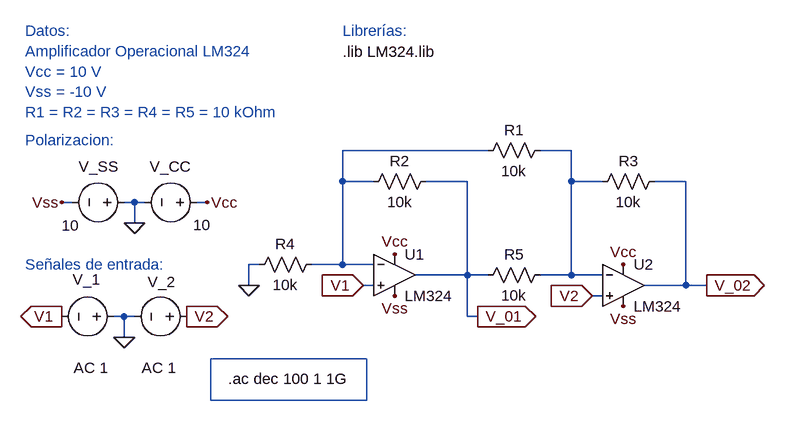
[diagram p0: schematic Lab_1_Circ_1_VD_frec.asc]
Lab_1_Circ_1_VD_frec.asc, the LTspice schematic file:
Version 4
SHEET 1 1560 680
WIRE 112 -192 -112 -192
WIRE 240 -192 192 -192
WIRE -112 -144 -112 -192
WIRE -64 -144 -112 -144
WIRE 80 -144 16 -144
WIRE 240 -144 240 -192
WIRE 288 -144 240 -144
WIRE 416 -144 368 -144
WIRE -528 -112 -544 -112
WIRE -432 -112 -448 -112
WIRE -416 -112 -432 -112
WIRE -320 -112 -336 -112
WIRE -432 -80 -432 -112
WIRE -240 -16 -256 -16
WIRE -112 -16 -112 -144
WIRE -112 -16 -160 -16
WIRE -64 -16 -112 -16
WIRE 80 0 80 -144
WIRE 80 0 0 0
WIRE 112 0 80 0
WIRE 240 0 240 -144
WIRE 240 0 192 0
WIRE 288 0 240 0
WIRE -256 16 -256 -16
WIRE -64 16 -80 16
WIRE 416 16 416 -144
WIRE 416 16 352 16
WIRE 448 16 416 16
WIRE 288 32 272 32
WIRE -448 64 -464 64
WIRE -432 64 -448 64
WIRE 80 64 80 0
WIRE 96 64 80 64
WIRE -448 96 -448 64
FLAG -256 16 0
FLAG -320 -112 Vcc
FLAG -32 -32 Vcc
FLAG 320 -16 Vcc
FLAG -544 -112 Vss
FLAG -32 32 Vss
FLAG 320 48 Vss
FLAG -432 -80 0
FLAG 96 64 V_01
IOPIN 96 64 Out
FLAG 448 16 V_02
IOPIN 448 16 Out
FLAG -80 16 V1
IOPIN -80 16 In
FLAG 272 32 V2
IOPIN 272 32 In
FLAG -352 64 V2
IOPIN -352 64 Out
FLAG -544 64 V1
IOPIN -544 64 Out
FLAG -448 96 0
SYMBOL OpAmps\\opamp2 -32 -64 R0
SYMATTR InstName U1
SYMATTR Value LM324
SYMBOL OpAmps\\opamp2 320 -48 R0
SYMATTR InstName U2
SYMATTR Value LM324
SYMBOL res 208 -208 R90
WINDOW 0 0 56 VBottom 2
WINDOW 3 32 56 VTop 2
SYMATTR InstName R1
SYMATTR Value 10k
SYMBOL res 32 -160 R90
WINDOW 0 0 56 VBottom 2
WINDOW 3 32 56 VTop 2
SYMATTR InstName R2
SYMATTR Value 10k
SYMBOL res 384 -160 R90
WINDOW 0 0 56 VBottom 2
WINDOW 3 32 56 VTop 2
SYMATTR InstName R3
SYMATTR Value 10k
SYMBOL res -144 -32 R90
WINDOW 0 0 56 VBottom 2
WINDOW 3 32 56 VTop 2
SYMATTR InstName R4
SYMATTR Value 10k
SYMBOL res 208 -16 R90
WINDOW 0 0 56 VBottom 2
WINDOW 3 32 56 VTop 2
SYMATTR InstName R5
SYMATTR Value 10k
SYMBOL voltage -320 -112 R90
WINDOW 0 -55 25 VRight 2
WINDOW 3 35 -5 VRight 2
WINDOW 123 0 0 Left 0
WINDOW 39 0 0 Left 0
SYMATTR InstName V_CC
SYMATTR Value 10
SYMBOL voltage -432 -112 R90
WINDOW 0 -55 25 VRight 2
WINDOW 3 36 85 VRight 2
WINDOW 123 0 0 Left 0
WINDOW 39 0 0 Left 0
SYMATTR InstName V_SS
SYMATTR Value 10
SYMBOL voltage -336 64 M270
WINDOW 0 53 76 VLeft 2
WINDOW 3 -51 85 VLeft 2
WINDOW 123 -79 85 VLeft 2
WINDOW 39 0 0 Left 0
SYMATTR InstName V_2
SYMATTR Value ""
SYMATTR Value2 AC 1
SYMBOL voltage -448 64 R90
WINDOW 0 -57 36 VRight 2
WINDOW 3 51 24 VRight 2
WINDOW 123 79 24 VRight 2
WINDOW 39 0 0 Left 0
SYMATTR InstName V_1
SYMATTR Value ""
SYMATTR Value2 AC 1
TEXT -112 -344 Left 2 !.lib LM324.lib
TEXT -112 -376 Left 2 ;Librerías:
TEXT -600 -208 Left 2 ;Polarizacion:
TEXT -600 -16 Left 2 ;Señales de entrada:
TEXT -600 -376 Left 2 ;Datos:\nAmplificador Operacional LM324\nVcc = 10 V\nVss = -10 V\nR1 = R2 = R3 = R4 = R5 = 10 kOhm
TEXT -288 160 Left 2 !.ac dec 100 1 1G
RECTANGLE Normal -75 193 -315 129

The netlist it stands for:
* Lab_1_Circ_1_VD_frec.asc
XU1 V1 N001 Vcc Vss V_01 LM324  ; pins In+ In- V+ V- OUT
XU2 V2 N002 Vcc Vss V_02 LM324  ; pins In+ In- V+ V- OUT
R1 N002 N001 10k
R2 V_01 N001 10k
R3 V_02 N002 10k
R4 N001 0 10k
R5 N002 V_01 10k
V_CC Vcc 0 10
V_SS 0 Vss 10
V_2 V2 0 AC 1
V_1 0 V1 AC 1
.lib LM324.lib
* Librerías:
* Polarizacion:
* Señales de entrada:
* Datos:
* Amplificador Operacional LM324
* Vcc = 10 V
* Vss = -10 V
* R1 = R2 = R3 = R4 = R5 = 10 kOhm
.ac dec 100 1 1G
.backanno
.end

* Results of the author's LTspice run, read from the files saved beside the schematic
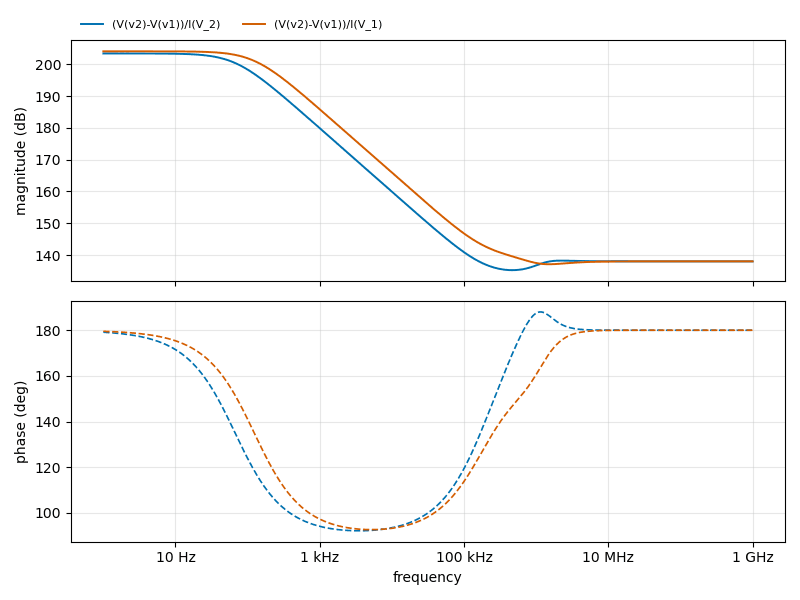
[diagram p1: AC Analysis of Lab_1_Circ_1_VD_frec.asc, plotted from the saved traces]
* AC Analysis, 1 run:
*   (V(v2)-V(v1))/I(V_2): 203.39 dB at 1 Hz, 138.04 dB at 1 GHz, peak 203.39 dB at 1 Hz, 3 dB below the peak at 67.08 Hz
*   (V(v2)-V(v1))/I(V_1): 204.06 dB at 1 Hz, 138.04 dB at 1 GHz, peak 204.06 dB at 1 Hz, 3 dB below the peak at 123.5 Hz